# Altium schematic sheet single_chebyshev.SchDoc
size A4
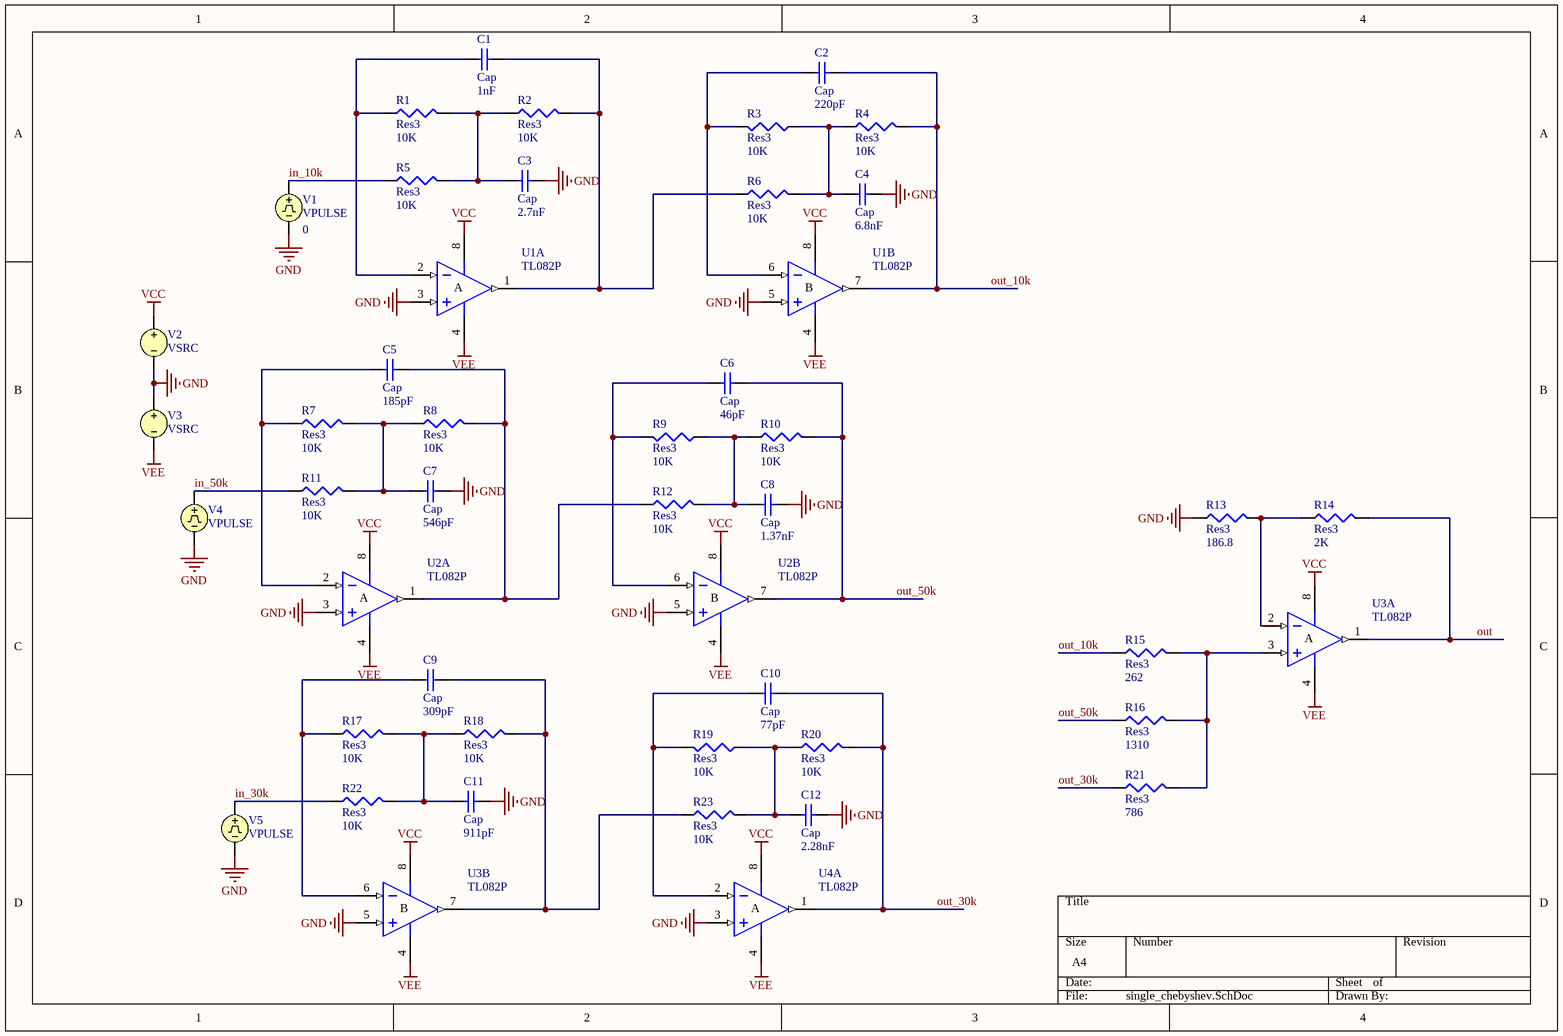
[diagram p0: single_chebyshev.SchDoc]

## Parts
C1  Cap  value 1nF  [RAD-0.3]
C2  Cap  value 220pF  [RAD-0.3]
C3  Cap  value 2.7nF  [RAD-0.3]
C4  Cap  value 6.8nF  [RAD-0.3]
C5  Cap  value 185pF  [RAD-0.3]
C6  Cap  value 46pF  [RAD-0.3]
C7  Cap  value 546pF  [RAD-0.3]
C8  Cap  value 1.37nF  [RAD-0.3]
C9  Cap  value 309pF  [RAD-0.3]
C10  Cap  value 77pF  [RAD-0.3]
C11  Cap  value 911pF  [RAD-0.3]
C12  Cap  value 2.28nF  [RAD-0.3]
R1  Res3  value 10K  [J1-0603]
R2  Res3  value 10K  [J1-0603]
R3  Res3  value 10K  [J1-0603]
R4  Res3  value 10K  [J1-0603]
R5  Res3  value 10K  [J1-0603]
R6  Res3  value 10K  [J1-0603]
R7  Res3  value 10K  [J1-0603]
R8  Res3  value 10K  [J1-0603]
R9  Res3  value 10K  [J1-0603]
R10  Res3  value 10K  [J1-0603]
R11  Res3  value 10K  [J1-0603]
R12  Res3  value 10K  [J1-0603]
R13  Res3  value 186.8  [J1-0603]
R14  Res3  value 2K  [J1-0603]
R15  Res3  value 262  [J1-0603]
R16  Res3  value 1310  [J1-0603]
R17  Res3  value 10K  [J1-0603]
R18  Res3  value 10K  [J1-0603]
R19  Res3  value 10K  [J1-0603]
R20  Res3  value 10K  [J1-0603]
R21  Res3  value 786  [J1-0603]
R22  Res3  value 10K  [J1-0603]
R23  Res3  value 10K  [J1-0603]
U1  TL082P  [P008]  (parts A,B of 2)
U2  TL082P  [P008]  (parts A,B of 2)
U3  TL082P  [P008]  (parts A,B of 2)
U4  TL082P  [P008]  (part A of 2)
V1  VPULSE  AC Phase: 0
V2  VSRC
V3  VSRC
V4  VPULSE
V5  VPULSE

## Nets
GND: C3.2 C4.2 C7.2 C8.2 C11.2 C12.2 R13.1 U1.3(IN+) U1.5(IN+) U2.3(IN+) U2.5(IN+) U3.5(IN+) U4.3(IN+) V1.2 V2.2 V3.1 V4.2 V5.2
VCC: U1.8(V+) U2.8(V+) U3.8(V+) U4.8(V+) V2.1
VEE: U1.4(V-) U2.4(V-) U3.4(V-) U4.4(V-) V3.2
in_10k: R5.1 V1.1
in_30k: R22.1 V5.1
in_50k: R11.1 V4.1
out: R14.2 U3.1(OUT)
out_10k: C2.2 R4.2 R15.1 U1.7(OUT)
out_30k: C10.2 R20.2 R21.1 U4.1(OUT)
out_50k: C6.2 R10.2 R16.1 U2.7(OUT)
NetC1_1: C1.1 R1.1 U1.2(IN-)
NetC1_2: C1.2 R2.2 R6.1 U1.1(OUT)
NetC2_1: C2.1 R3.2 U1.6(IN-)
NetC3_1: C3.1 R1.2 R2.1 R5.2
NetC4_1: C4.1 R3.1 R4.1 R6.2
NetC5_1: C5.1 R7.1 U2.2(IN-)
NetC5_2: C5.2 R8.2 R12.1 U2.1(OUT)
NetC6_1: C6.1 R9.2 U2.6(IN-)
NetC7_1: C7.1 R7.2 R8.1 R11.2
NetC8_1: C8.1 R9.1 R10.1 R12.2
NetC9_1: C9.1 R17.1 U3.6(IN-)
NetC9_2: C9.2 R18.2 R23.1 U3.7(OUT)
NetC10_1: C10.1 R19.2 U4.2(IN-)
NetC11_1: C11.1 R17.2 R18.1 R22.2
NetC12_1: C12.1 R19.1 R20.1 R23.2
NetR13_2: R13.2 R14.1 U3.2(IN-)
NetR15_2: R15.2 R16.2 R21.2 U3.3(IN+)

## Notes on the sheet
- (in symbol TL082P, part A) A
- (in symbol TL082P, part B) B

## Library data of the parts
C1-C12 = Cap: Capacitor; Published: 8-Jun-2000; LatestRevisionDate: 17-Jul-2002; LatestRevisionNote: Re-released for DXP Platform.; PackageReference: RAD-0.3; Publisher: Altium Limited; PackageDescription: Radial Cap, Thru-Hole; 2 Leads; 0.3 in Pin Spacing
R1-R23 = Res3: Resistor; Published: 8-Jun-2000; LatestRevisionDate: 29-May-2009; LatestRevisionNote: IPC-7351 Footprint Added.; PackageReference: J1-0603; Publisher: Altium Limited; PackageDescription: Chip Resistor
U1-U4 = TL082P: JFET-Input Operational Amplifier; Published: 16-Jan-2001; LatestRevisionDate: 04-Mar-2005; LatestRevisionNote: Stylized 3D Model Added.; DatasheetVersion: Feb-1999; PackageVersion: Jun-1999; PackageReference: P008; Publisher: Altium Limited; PackageDescription: DIP; 8 Leads; Row Spacing 7.62 mm; Pitch 2.54 mm; Code_JEDEC: MO-001-AN; ComponentLink1Description: Manufacturer Link; ComponentLink1URL: http://www.ti.com/; ComponentLink2Description: Datasheet; ComponentLink2URL: http://www-s.ti.com/sc/ds/tl082.pdf
V1 V4 V5 = VPULSE: Pulse Voltage Source; Note: PCB Footprint - Not required; Published: 8-Jun-2000; LatestRevisionDate: 15-Nov-2004; LatestRevisionNote: Corrected Netlist.; PackageReference: Not Applicable; Publisher: Altium Limited
V2 V3 = VSRC: Voltage Source; Note: PCB Footprint - Not required; Value: 15; Published: 8-Jun-2000; LatestRevisionDate: 17-Jul-2002; LatestRevisionNote: Re-released for DXP Platform.; PackageReference: Not Applicable; Publisher: Altium Limited